# Altium schematic sheet Motor_Controllers.SchDoc
size A; SheetNumber: 3; SheetTotal: 6
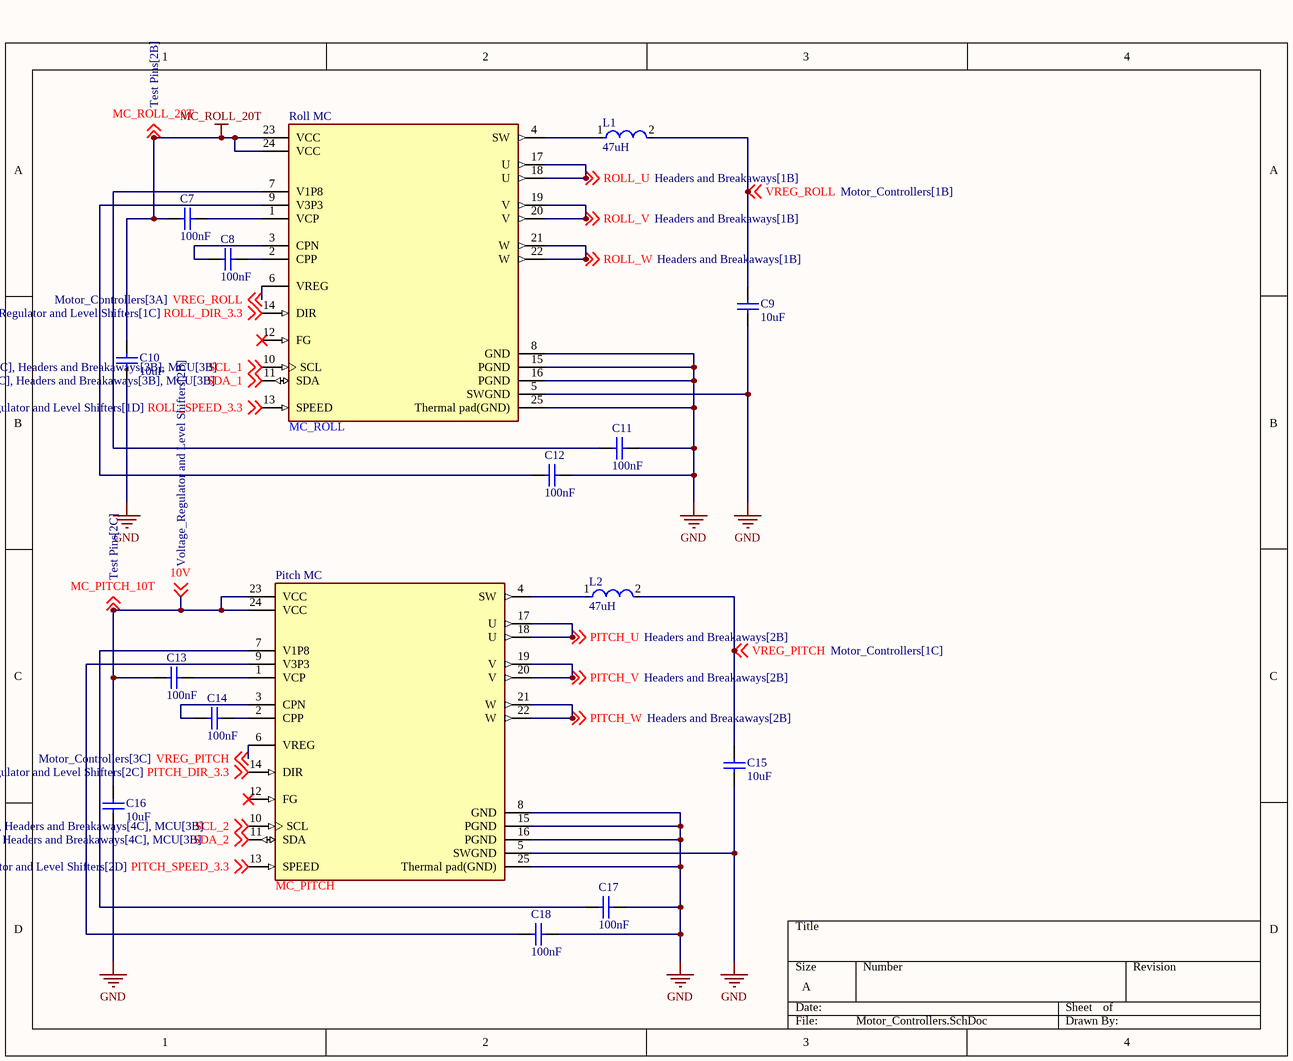
[diagram p0: Motor_Controllers.SchDoc]

## Parts
C7  100nF  [0805]
C8  100nF  [0805]
C9  10uF  [0805]
C10  10uF  [0805]
C11  100nF  [0805]
C12  100nF  [0805]
C13  100nF  [0805]
C14  100nF  [0805]
C15  10uF  [0805]
C16  10uF  [0805]
C17  100nF  [0805]
C18  100nF  [0805]
L1  47uH  [FP-LQM21DH_70-IPC_A]
L2  47uH  [FP-LQM21DH_70-IPC_A]
Pitch_MC  MC_PITCH  [FP-PWP0024B-MFG]
Roll_MC  MC_ROLL  [FP-PWP0024B-MFG]

## Nets
GND: C9.1 C10.1 C11.2 C12.2 C15.1 C16.1 C17.2 C18.2 Pitch_MC.5(SWGND) Pitch_MC.8(GND) Pitch_MC.15(PGND) Pitch_MC.16(PGND) Pitch_MC.25(Thermal_pad(GND)) Roll_MC.5(SWGND) Roll_MC.8(GND) Roll_MC.15(PGND) Roll_MC.16(PGND) Roll_MC.25(Thermal_pad(GND))
MC_ROLL_20T: C7.1 C10.2 Roll_MC.23(VCC) Roll_MC.24(VCC) ; off-sheet MC_ROLL_20T
10V: C13.1 C16.2 Pitch_MC.23(VCC) Pitch_MC.24(VCC) ; off-sheet 10V, off-sheet MC_PITCH_10T  [also labelled MC_PITCH_10T]
PITCH_DIR_3.3: Pitch_MC.14(DIR) ; off-sheet PITCH_DIR_3.3
PITCH_SPEED_3.3: Pitch_MC.13(SPEED) ; off-sheet PITCH_SPEED_3.3
PITCH_U: Pitch_MC.17(U) Pitch_MC.18(U) ; off-sheet PITCH_U
PITCH_V: Pitch_MC.19(V) Pitch_MC.20(V) ; off-sheet PITCH_V
PITCH_W: Pitch_MC.21(W) Pitch_MC.22(W) ; off-sheet PITCH_W
ROLL_DIR_3.3: Roll_MC.14(DIR) ; off-sheet ROLL_DIR_3.3
ROLL_SPEED_3.3: Roll_MC.13(SPEED) ; off-sheet ROLL_SPEED_3.3
ROLL_U: Roll_MC.17(U) Roll_MC.18(U) ; off-sheet ROLL_U
ROLL_V: Roll_MC.19(V) Roll_MC.20(V) ; off-sheet ROLL_V
ROLL_W: Roll_MC.21(W) Roll_MC.22(W) ; off-sheet ROLL_W
SCL_1: Roll_MC.10(SCL) ; off-sheet SCL_1
SCL_2: Pitch_MC.10(SCL) ; off-sheet SCL_2
SDA_1: Roll_MC.11(SDA) ; off-sheet SDA_1
SDA_2: Pitch_MC.11(SDA) ; off-sheet SDA_2
VREG_PITCH: C15.2 L2.2 Pitch_MC.6(VREG) ; off-sheet VREG_PITCH
VREG_ROLL: C9.2 L1.2 Roll_MC.6(VREG) ; off-sheet VREG_ROLL
NetC7_2: C7.2 Roll_MC.1(VCP)
NetC8_1: C8.1 Roll_MC.3(CPN)
NetC8_2: C8.2 Roll_MC.2(CPP)
NetC11_1: C11.1 Roll_MC.7(V1P8)
NetC12_1: C12.1 Roll_MC.9(V3P3)
NetC13_2: C13.2 Pitch_MC.1(VCP)
NetC14_1: C14.1 Pitch_MC.3(CPN)
NetC14_2: C14.2 Pitch_MC.2(CPP)
NetC17_1: C17.1 Pitch_MC.7(V1P8)
NetC18_1: C18.1 Pitch_MC.9(V3P3)
NetL1_1: L1.1 Roll_MC.4(SW)
NetL2_1: L2.1 Pitch_MC.4(SW)

Not connected (* = marked no-connect by the designer): Pitch_MC 12(FG)*; Roll_MC 12(FG)*

## Library data of the parts
C7 C8 C11-C14 C17 C18 = nF - 100nF (0.1uF): CAP Ceramic, 100nF, 50V, 0805; MPN: CC0805KRX7R9BB104; Manufacturer: YAGEO; Capacitance: 100nF; JLCPCB Part #: C49678; Voltage Rating: 50V; JLCPCB Basic Part: TRUE
C9 C10 C15 C16 = uF - 10uF: CAP Ceramic, 10uF, 50V, 0805; MPN: GRM21BR61H106KE43L; Manufacturer: Murata Electronics; Capacitance: 10uF; JLCPCB Part #: C440198; Voltage Rating: 50V; JLCPCB Basic Part: TRUE
L1 L2 = CMP-06042-016981-1: Multilayer Type Inductor for Power Lines, 0805 (2012), 47μH, 30%, 1.2Ω, 7mA; MPN: LQM21DN470N00L; Test Frequency: 1MHz; Self Resonant Frequency: 7.5MHz; DC Resistance (DCR): 1.2R; Core Material: Ferrite; Shielding: Shielded; Packaging: Tape and Reel; Max Operating Temperature: 85°C; Min Operating Temperature: -40°C; Height: 0.049inch; Case Code (Imperial): 0805; Radiation Hardening: No; Termination: SMD/SMT; Length: 2mm; Depth: 1.45mm; Package Quantity: 3000; Case Code (Metric): 2012; Current Rating: 7mA; RoHS Compliant: Yes; Lead Free: Lead Free; Tolerance: 30%; Military Standard: Not; Inductance: 47uH; Case/Package: 0805; Max DC Current: 7mA; Series: LQM21D; Width: 0.049inch; DC Current: 7mA; Mount: Surface Mount
Pitch_MC Roll_MC = CMP-04915-000055-1: IC MOTOR DRIVER 8V-28V 24HTSSOP; MPN: DRV10983PWPR; Output Current: 2A; Interface: I2C; Output Voltage: 24V; Logic Function: AND GATE; Operating Supply Voltage: 26V; RoHS Compliant: Yes; Max Operating Temperature: 125°C; Packaging: Tape and Reel; Lead Free: Lead Free; Min Operating Temperature: -40°C; Mount: Surface Mount; Radiation Hardening: No; Number of Pins: 24